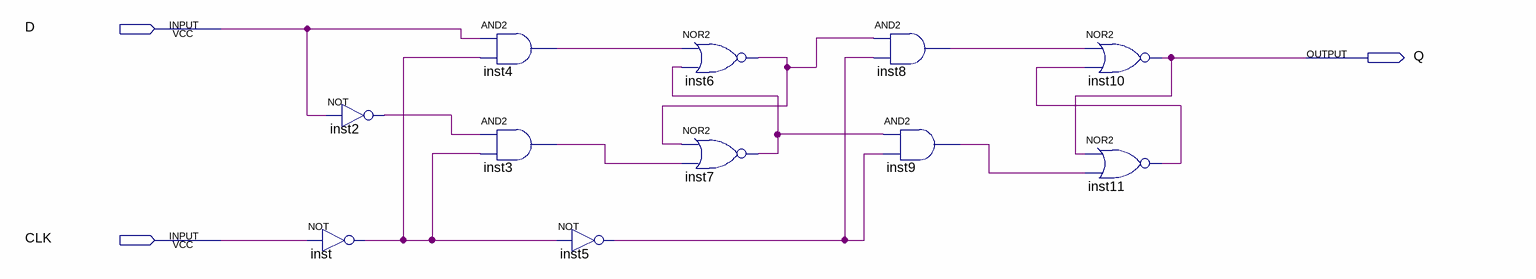
[diagram p0: schematic sheet]
// Quartus schematic FD.bdf as structural Verilog: 11 symbols, 3 pins
module FD (
  input  D,
  input  CLK,
  output Q
);

  wire inst2_out, inst3_out, inst4_out, inst5_out, inst6_out, inst7_out, inst8_out, inst9_out, inst11_out,
       inst_out;

  not inst2 (inst2_out, D);
  not inst (inst_out, CLK);
  and inst4 (inst4_out, D, inst_out);
  and inst3 (inst3_out, inst2_out, inst_out);
  not inst5 (inst5_out, inst_out);
  nor inst6 (inst6_out, inst4_out, inst7_out);
  nor inst7 (inst7_out, inst6_out, inst3_out);
  and inst8 (inst8_out, inst6_out, inst5_out);
  and inst9 (inst9_out, inst7_out, inst5_out);
  nor inst10 (Q, inst8_out, inst11_out);
  nor inst11 (inst11_out, Q, inst9_out);
endmodule
